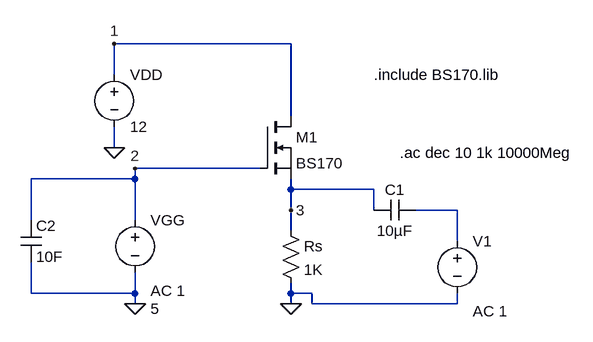
[diagram p0: schematic ts5_mos.asc]
ts5_mos.asc, the LTspice schematic file:
Version 4
SHEET 1 880 680
WIRE 224 0 -48 0
WIRE -48 48 -48 0
WIRE 224 112 224 0
WIRE -48 160 -48 128
WIRE 176 192 -16 192
WIRE -16 208 -16 192
WIRE -16 208 -176 208
WIRE 224 224 224 208
WIRE 352 224 224 224
WIRE 224 256 224 224
WIRE 352 256 352 224
WIRE 480 256 416 256
WIRE -176 272 -176 208
WIRE -16 272 -16 208
WIRE 224 288 224 256
WIRE 480 304 480 256
WIRE -176 384 -176 336
WIRE -16 384 -16 352
WIRE -16 384 -176 384
WIRE 224 384 224 368
WIRE 256 384 224 384
WIRE -16 400 -16 384
WIRE 224 400 224 384
WIRE 256 400 256 384
WIRE 480 400 480 384
WIRE 480 400 256 400
FLAG -48 160 0
FLAG 224 400 0
FLAG -16 400 0
FLAG -16 192 2
FLAG 224 256 3
FLAG -48 0 1
SYMBOL nmos 176 112 R0
SYMATTR InstName M1
SYMATTR Value BS170
SYMATTR Prefix X
SYMBOL voltage -48 32 R0
SYMATTR InstName VDD
SYMATTR Value 12
SYMBOL res 208 272 R0
SYMATTR InstName Rs
SYMATTR Value 1K
SYMBOL voltage -16 256 R0
WINDOW 3 24 152 Left 2
WINDOW 123 24 124 Left 2
WINDOW 39 0 0 Left 0
SYMATTR InstName VGG
SYMATTR Value 5
SYMATTR Value2 AC 1
SYMBOL cap -192 272 R0
SYMATTR InstName C2
SYMATTR Value 10F
SYMBOL voltage 480 288 R0
WINDOW 123 24 124 Left 2
WINDOW 39 0 0 Left 0
SYMATTR InstName V1
SYMATTR Value ""
SYMATTR Value2 AC 1
SYMBOL cap 416 240 R90
WINDOW 0 0 32 VBottom 2
WINDOW 3 32 32 VTop 2
SYMATTR InstName C1
SYMATTR Value 10µF
TEXT 352 48 Left 2 !.include BS170.lib
TEXT 392 168 Left 2 !.ac dec 10 1k 10000Meg

The netlist it stands for:
* ts5_mos.asc
XM1 1 2 3 BS170  ; pins D G S
VDD 1 0 12
Rs 3 0 1K
VGG 2 0 5 AC 1
C2 2 0 10F
V1 N001 0 AC 1
C1 N001 3 10µF
.include BS170.lib
.ac dec 10 1k 10000Meg
.backanno
.end